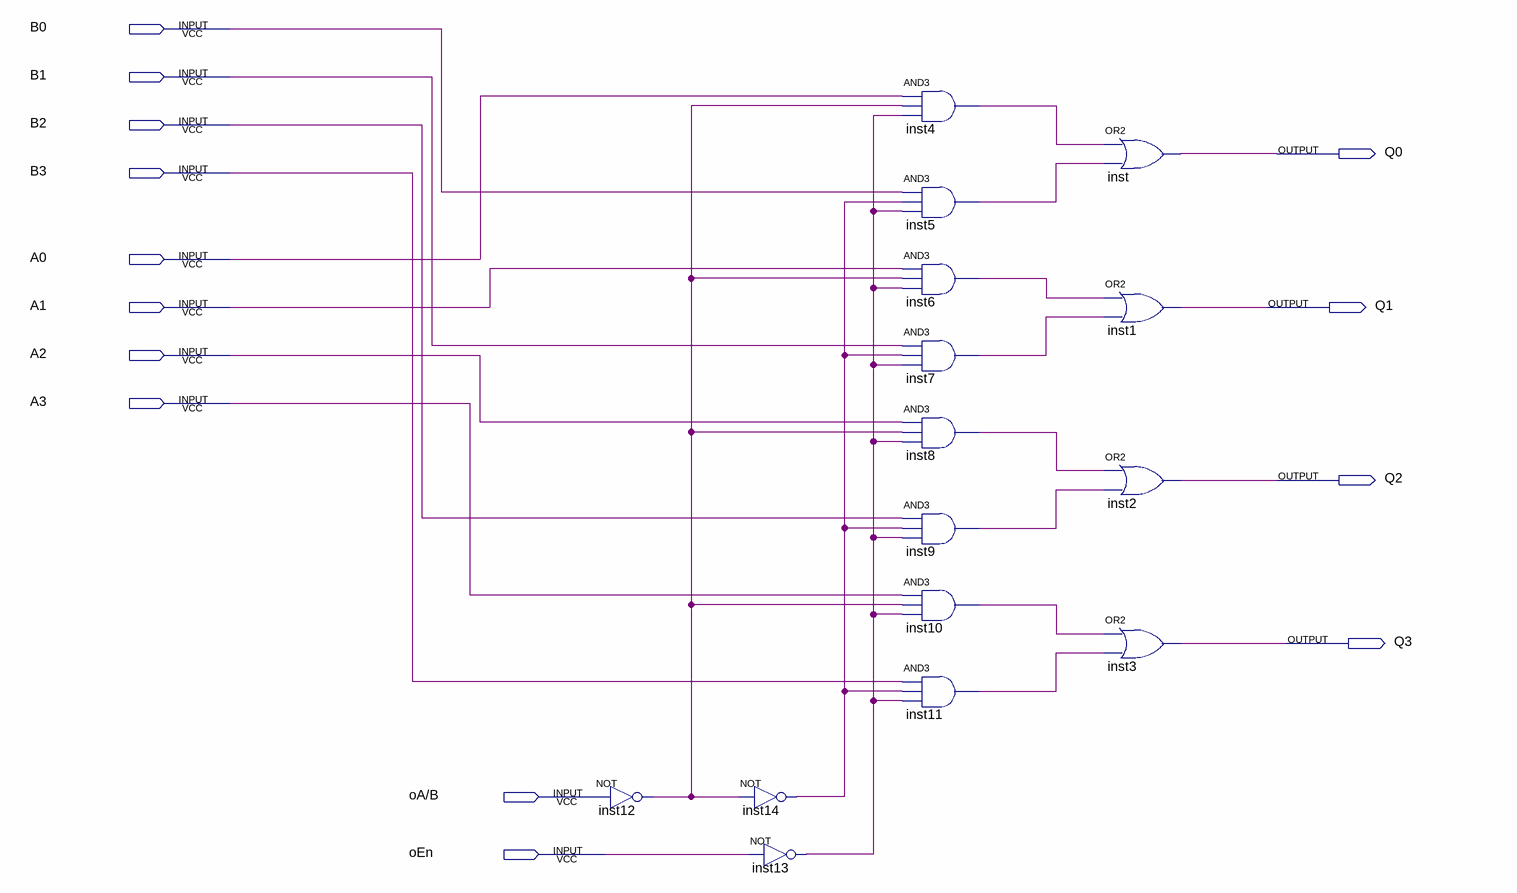
[diagram p0: schematic sheet]
// Quartus schematic Demultiplexador_de_Endereco.bdf as structural Verilog: 15 symbols, 14 pins
module Demultiplexador_de_Endereco (
  input  B0,
  input  B1,
  input  B2,
  input  B3,
  input  A0,
  input  A1,
  input  A2,
  input  A3,
  input  \oA/B ,
  input  oEn,
  output Q0,
  output Q1,
  output Q2,
  output Q3
);

  wire inst4_out, inst5_out, inst6_out, inst7_out, inst8_out, inst9_out, inst10_out, inst11_out, inst12_out,
       inst13_out, inst14_out;

  // NOT inst12 has open pins: IN=open, OUT=inst12_out
  not inst14 (inst14_out, inst12_out);
  not inst13 (inst13_out, oEn);
  and inst4 (inst4_out, A0, inst12_out, inst13_out);
  and inst5 (inst5_out, B0, inst14_out, inst13_out);
  and inst6 (inst6_out, A1, inst12_out, inst13_out);
  and inst7 (inst7_out, B1, inst14_out, inst13_out);
  and inst8 (inst8_out, A2, inst12_out, inst13_out);
  and inst9 (inst9_out, B2, inst14_out, inst13_out);
  and inst10 (inst10_out, A3, inst12_out, inst13_out);
  and inst11 (inst11_out, B3, inst14_out, inst13_out);
  or inst (Q0, inst4_out, inst5_out);
  or inst1 (Q1, inst6_out, inst7_out);
  or inst2 (Q2, inst8_out, inst9_out);
  or inst3 (Q3, inst10_out, inst11_out);
endmodule
